# Altium schematic sheet Main_Schematic.SchDoc: Title
size A4; Date: *******; ApprovedBy: *******; CheckedBy: Yasiru; Author: *******; CompanyName: *******; DrawnBy: Lasith Haputhanthri; Engineer: *******; Organization: *******; Address1: *******; Address2: *******; Address3: *******; Address4: *******; DocumentNumber: 1; Revision: *******; SheetNumber: 1; SheetTotal: 11; Subtitle: Main Schematic; Project: Resturant Robot; VersionRevision: II; TotalSheet: 11; CurrentTime: *******; CurrentDate: *******; Time: *******; DocumentFullPathAndName: *******; DocumentName: *******; ModifiedDate: *******; ImagePath: *******; ProjectName: *******; Application_BuildNumber: *******
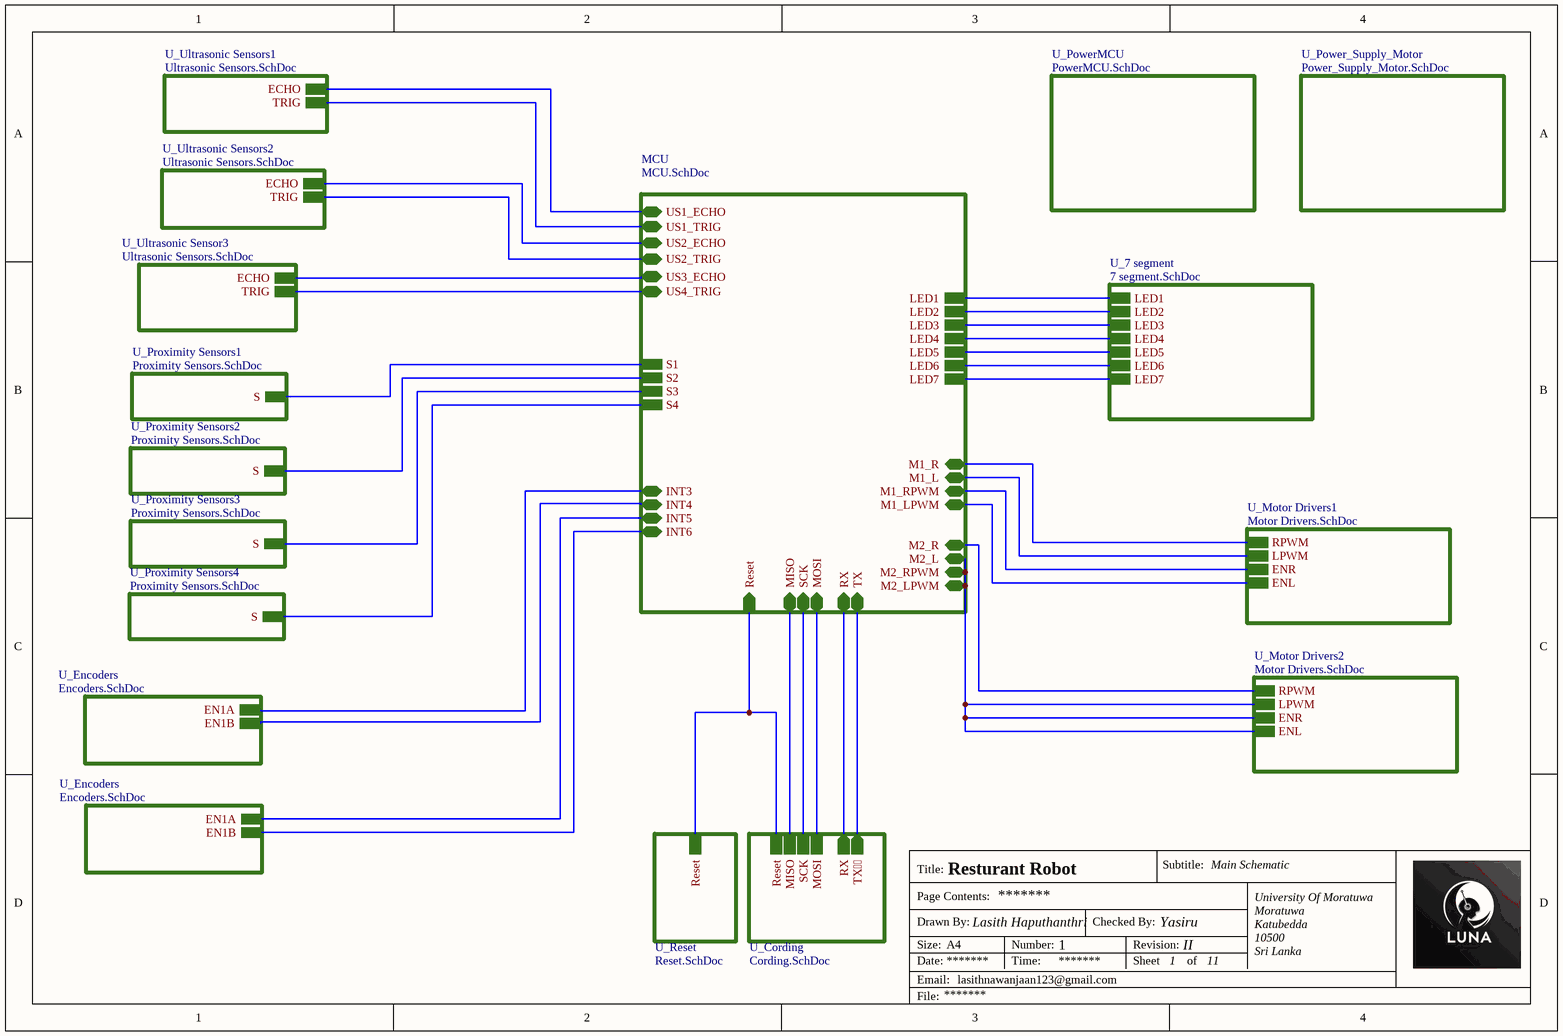
[diagram p0: Main_Schematic.SchDoc]

## Sub-sheets
MCU = MCU.SchDoc: Reset (in), INT3 (bidir), INT4 (bidir), INT5 (bidir), INT6 (bidir), M1_RPWM (bidir), M1_LPWM (bidir), M2_RPWM (bidir), M2_LPWM (bidir), M1_R (bidir), M1_L (bidir), M2_R (bidir), M2_L (bidir), TX (bidir), RX (bidir), SCK (bidir), MOSI (bidir), MISO (bidir), US1_ECHO (bidir), US1_TRIG (bidir), US2_ECHO (bidir), US2_TRIG (bidir), US3_ECHO (bidir), US4_TRIG (bidir), LED1, LED2, LED3, LED4, LED5, LED6, LED7, S1, S2, S3, S4
U_7 segment = 7 segment.SchDoc: LED1, LED2, LED3, LED4, LED5, LED6, LED7
U_Cording = Cording.SchDoc: MOSI, Reset, SCK, MISO, RX (out), TX (out)
U_Encoders = Encoders.SchDoc: EN1A, EN1B
U_Encoders = Encoders.SchDoc: EN1A, EN1B
U_Motor Drivers1 = Motor Drivers.SchDoc: RPWM, LPWM, ENR, ENL
U_Motor Drivers2 = Motor Drivers.SchDoc: RPWM, LPWM, ENR, ENL
U_Power_Supply_Motor = Power_Supply_Motor.SchDoc: no entries
U_PowerMCU = PowerMCU.SchDoc: no entries
U_Proximity Sensors1 = Proximity Sensors.SchDoc: S
U_Proximity Sensors2 = Proximity Sensors.SchDoc: S
U_Proximity Sensors3 = Proximity Sensors.SchDoc: S
U_Proximity Sensors4 = Proximity Sensors.SchDoc: S
U_Reset = Reset.SchDoc: Reset
U_Ultrasonic Sensor3 = Ultrasonic Sensors.SchDoc: ECHO, TRIG
U_Ultrasonic Sensors1 = Ultrasonic Sensors.SchDoc: ECHO, TRIG
U_Ultrasonic Sensors2 = Ultrasonic Sensors.SchDoc: ECHO, TRIG

## Nets
(unnamed): sheet MCU/Reset, sheet U_Reset/Reset, sheet U_Cording/Reset
(unnamed): sheet MCU/INT3, sheet U_Encoders/EN1A
(unnamed): sheet MCU/INT4, sheet U_Encoders/EN1B
(unnamed): sheet MCU/INT5, sheet U_Encoders/EN1A
(unnamed): sheet MCU/INT6, sheet U_Encoders/EN1B
(unnamed): sheet MCU/M1_RPWM, sheet U_Motor Drivers1/ENR
(unnamed): sheet MCU/M1_LPWM, sheet U_Motor Drivers1/ENL
(unnamed): sheet MCU/M2_RPWM, sheet MCU/M2_LPWM, sheet MCU/M2_L, sheet U_Motor Drivers2/LPWM, sheet U_Motor Drivers2/ENR, sheet U_Motor Drivers2/ENL
(unnamed): sheet MCU/M1_R, sheet U_Motor Drivers1/RPWM
(unnamed): sheet MCU/M1_L, sheet U_Motor Drivers1/LPWM
(unnamed): sheet MCU/M2_R, sheet U_Motor Drivers2/RPWM
(unnamed): sheet MCU/TX, sheet U_Cording/TX
(unnamed): sheet MCU/RX, sheet U_Cording/RX
(unnamed): sheet MCU/SCK, sheet U_Cording/SCK
(unnamed): sheet MCU/MOSI, sheet U_Cording/MOSI
(unnamed): sheet MCU/MISO, sheet U_Cording/MISO
(unnamed): sheet MCU/US1_ECHO, sheet U_Ultrasonic Sensors1/ECHO
(unnamed): sheet MCU/US1_TRIG, sheet U_Ultrasonic Sensors1/TRIG
(unnamed): sheet MCU/US2_ECHO, sheet U_Ultrasonic Sensors2/ECHO
(unnamed): sheet MCU/US2_TRIG, sheet U_Ultrasonic Sensors2/TRIG
(unnamed): sheet MCU/US3_ECHO, sheet U_Ultrasonic Sensor3/ECHO
(unnamed): sheet MCU/US4_TRIG, sheet U_Ultrasonic Sensor3/TRIG
(unnamed): sheet MCU/LED1, sheet U_7 segment/LED1
(unnamed): sheet MCU/LED2, sheet U_7 segment/LED2
(unnamed): sheet MCU/LED3, sheet U_7 segment/LED3
(unnamed): sheet MCU/LED4, sheet U_7 segment/LED4
(unnamed): sheet MCU/LED5, sheet U_7 segment/LED5
(unnamed): sheet MCU/LED6, sheet U_7 segment/LED6
(unnamed): sheet MCU/LED7, sheet U_7 segment/LED7
(unnamed): sheet MCU/S1, sheet U_Proximity Sensors1/S
(unnamed): sheet MCU/S2, sheet U_Proximity Sensors2/S
(unnamed): sheet MCU/S3, sheet U_Proximity Sensors3/S
(unnamed): sheet MCU/S4, sheet U_Proximity Sensors4/S

## Notes on the sheet
- Title:
- Drawn By:
- Page Contents:
- Checked By:
- Subtitle:
- University Of Moratuwa
- Moratuwa
- Size:
- Date:
- File:
- Email:
- A4
- lasithnawanjaan123@gmail.com
- Lasith Haputhanthri
- Number:
- Time:
- Revision:
- Sheet
- of
- Katubedda
- 10500
- Sri Lanka